# Altium schematic sheet Power.SchDoc
size A4; DocumentNumber: 4; SheetNumber: 2; SheetTotal: 5; SPICEModelCache: <root> / <DocumentId>FYMTCRTF</DocumentId> / <CacheFrame Number="0"> / <Model Name="3020_74438336033_3.3u" Kind="CKT"> / <Text>******* / .subckt 3020_74438336033_3.3u 1 2 / Rp 1 2 6097.32637741 / Cp 1 2 5.7471916388p / Rs 1 N3 0.099 / L1 N3 2 2.92u / .ends 3020_74438336033_3.3u</Text> / </Model> / </CacheFrame> / </root>
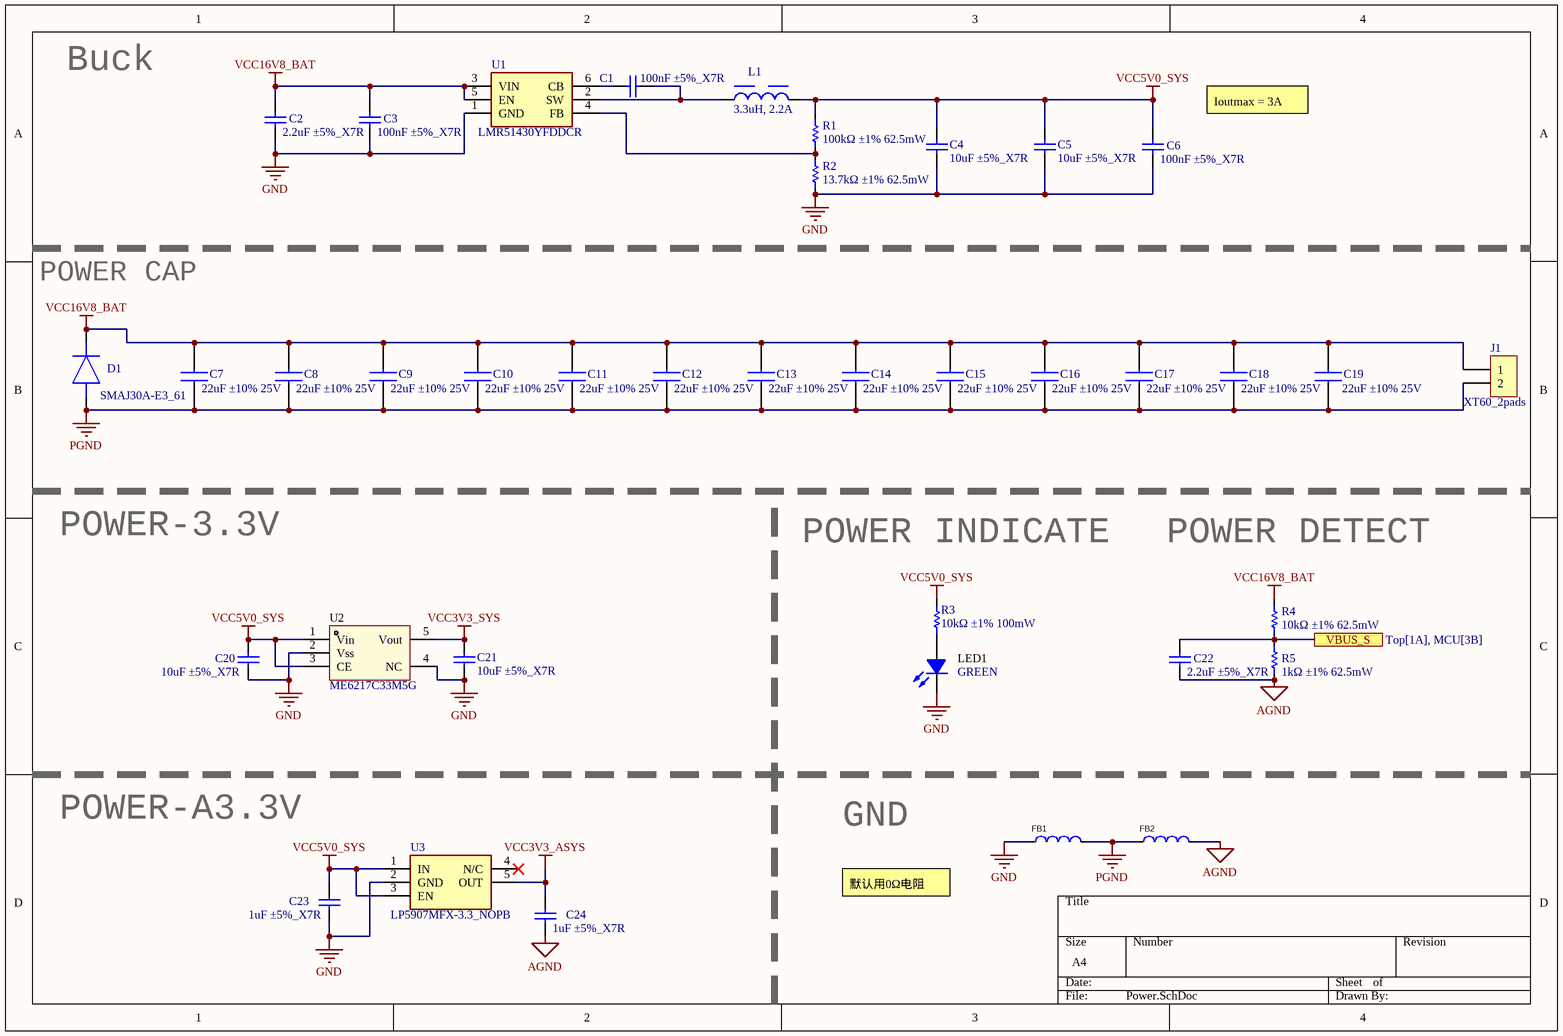
[diagram p0: Power.SchDoc]

## Parts
C1  100nF ±5%_X7R  [C0402]
C2  2.2uF ±5%_X7R  [C0603]
C3  100nF ±5%_X7R  [C0402]
C4  10uF ±5%_X7R  [C0603]
C5  10uF ±5%_X7R  [C0603]
C6  100nF ±5%_X7R  [C0402]
C7  22uF ±10% 25V  [CAPC3225X270N]
C8  22uF ±10% 25V  [CAPC3225X270N]
C9  22uF ±10% 25V  [CAPC3225X270N]
C10  22uF ±10% 25V  [CAPC3225X270N]
C11  22uF ±10% 25V  [CAPC3225X270N]
C12  22uF ±10% 25V  [CAPC3225X270N]
C13  22uF ±10% 25V  [CAPC3225X270N]
C14  22uF ±10% 25V  [CAPC3225X270N]
C15  22uF ±10% 25V  [CAPC3225X270N]
C16  22uF ±10% 25V  [CAPC3225X270N]
C17  22uF ±10% 25V  [CAPC3225X270N]
C18  22uF ±10% 25V  [CAPC3225X270N]
C19  22uF ±10% 25V  [CAPC3225X270N]
C20  10uF ±5%_X7R  [C0603]
C21  10uF ±5%_X7R  [C0603]
C22  2.2uF ±5%_X7R  [C0402]
C23  1uF ±5%_X7R  [C0603]
C24  1uF ±5%_X7R  [C0603]
D1  SMAJ30A-E3_61  [DIOM5127X229N]
FB1  ?Ω@100MHz  [BEADC1608X75N]  (value not drawn)
FB2  ?Ω@100MHz  [BEADC1608X75N]  (value not drawn)
J1  XT60_2pads  [XT60_2pads]
L1  3.3uH, 2.2A  [WE-MAPI_3020]
LED1  GREEN  [LED0603-RD]
R1  100kΩ ±1% 62.5mW  [R0402]
R2  13.7kΩ ±1% 62.5mW  [R0402]
R3  10kΩ ±1% 100mW  [R0603]
R4  10kΩ ±1% 62.5mW  [R0402]
R5  1kΩ ±1% 62.5mW  [R0402]
U1  LMR51430YFDDCR  [SOT95P280X110-6N]
U2  ME6217C33M5G  [SOT-23-5_L3.0-W1.7-P0.95-LS2.8-BR]
U3  LP5907MFX-3.3_NOPB  [SOT95P280X145-5N]

## Ports
VBUS_S (see Top[1A], MCU[3B])

## Nets
AGND: C22.1 C24.1 FB2.2 R5.1
GND: C2.1 C3.1 C4.1 C5.1 C6.1 C20.1 C21.1 C23.1 FB1.1 LED1.2(K) R2.1 U1.1(GND) U2.2(Vss) U2.4(NC) U3.2(GND)
PGND: C7.1 C8.1 C9.1 C10.1 C11.1 C12.1 C13.1 C14.1 C15.1 C16.1 C17.1 C18.1 C19.1 D1.2(A) FB1.2 FB2.1 J1.2
VCC3V3_ASYS: C24.2 U3.5(OUT)
VCC3V3_SYS: C21.2 U2.5(Vout)
VCC5V0_SYS: C4.2 C5.2 C6.2 C20.2 C23.2 L1.2 R1.2 R3.2 U2.1(Vin) U2.3(CE) U3.1(IN) U3.3(EN)
VCC16V8_BAT: C2.2 C3.2 C7.2 C8.2 C9.2 C10.2 C11.2 C12.2 C13.2 C14.2 C15.2 C16.2 C17.2 C18.2 C19.2 D1.1(K) J1.1 R4.2 U1.3(VIN) U1.5(EN)
VBUS_S: C22.2 R4.1 R5.2 ; port VBUS_S
NetC1_1: C1.1 L1.1 U1.2(SW)
NetC1_2: C1.2 U1.6(CB)
NetLED1_1: LED1.1(A) R3.1
NetR1_1: R1.1 R2.2 U1.4(FB)

Not connected (* = marked no-connect by the designer): U3 4(N/C)*

## Notes on the sheet
- Buck
- Ioutmax = 3A
- POWER CAP
- POWER-3.3V
- POWER INDICATE
- POWER DETECT
- POWER-A3.3V
- GND
- 默认用0Ω电阻

## Library data of the parts
C1-C6 C20-C24 = Cap: Capacitor; Published: 8-Jun-2000; LatestRevisionDate: 17-Jul-2002; LatestRevisionNote: Re-released for DXP Platform.; PackageReference: RAD-0.3; Publisher: Altium Limited; PackageDescription: Radial Cap, Thru-Hole; 2 Leads; 0.3 in Pin Spacing
C7-C19 = CL32A226KAJNNNE: Capacitor; Manufacturer_Name: SAMSUNG; Datasheet Link: https://www.arrow.com/en/products/cl32a226kajnnne/samsung-electro-mechanics; Height: 2.7mm; Manufacturer_Part_Number: CL32A226KAJNNNE; Mouser Part Number: 187-CL32A226KAJNNNE; Mouser Price/Stock: https://www.mouser.co.uk/ProductDetail/Samsung-Electro-Mechanics/CL32A226KAJNNNE?qs=hqM3L16%252BxlenZa7Di5a%252Buw%3D%3D; Arrow Part Number: CL32A226KAJNNNE; Arrow Price/Stock: https://www.arrow.com/en/products/cl32a226kajnnne/samsung-electro-mechanics?region=nac
D1 = SMAJ30A-E3_61: Diode; Manufacturer_Name: Vishay; Manufacturer_Part_Number: SMAJ30A-E3/61; Datasheet Link: http://www.vishay.com/docs/88390/smaj50a.pdf; Height: 2.29mm; Mouser Part Number: 625-SMAJ30A-E3; Mouser Price/Stock: https://www.mouser.co.uk/ProductDetail/Vishay-General-Semiconductor/SMAJ30A-E3-61?qs=M2MvrwIlMUxWAZKdikEp%2Fw%3D%3D; Arrow Part Number: SMAJ30A-E3/61; Arrow Price/Stock: https://www.arrow.com/en/products/smaj30a-e361/vishay?region=nac
FB1 FB2 = Ferrite Bead: MPZ1608S601ATA00; Manufacturer: FH(风华); Name: CBW321609U601T; Add into BOM: yes; Impedance @ Frequency: 600Ω@100MHz; Tolerance: ±25%; DC Resistance: 250mΩ; Current Rating: 2A; Circuits: 1; Symbol: CBW321609U601T; Device: CBW321609U601T; LCSC Part Name: 600Ω@100MHz ±25%; Supplier Part: C73732; Manufacturer Part: CBW321609U601T; Supplier Footprint: SMD; JLCPCB Part Class: Extended Part; Datasheet: https://atta.szlcsc.com/upload/public/pdf/source/20160606/1465200211209.pdf; Supplier: LCSC; Convert to PCB: yes
L1 = 74438336033: WE-MAPI, size 3020, 3.3uH, 2.2A, 114mOhm; Manufacturer: Wurth Elektronik; Case/Size Code: 3020; DC Resistance: 99mOhm; Saturation Current: 4.25A; Self Resonant Frequency: 39MHz; Manufacturer Part Number: 74438336033; Match Code: WE-MAPI; ComponentLink1Description: Website Link; ComponentLink1URL: https://www.we-online.com/redexpert/article/74438336033?ad; ComponentLink2Description: Datasheet Link; ComponentLink2URL: https://www.we-online.com/redexpert/spec/74438336033?ad; Mount: Surface Mount; Operating Temperature Max: 125°C; Operating Temperature Min: -40°C; Packaging: Tape and Reel; Length: 3mm; Width: 3mm; Height: 2mm; DC Resistance Max: 114mOhm; Inductance: 3.3uH; Rated Current: 2.2A
LED1 = LED: 发光颜色:; Manufacturer: EVERLIGHT(亿光); Name: 17-21SURC/S530-A2/TR8; Add into BOM: yes; Emitted Color: 红灯; Symbol: 17-21SURC/S530-A2/TR8; Device: 17-21SURC/S530-A2/TR8; LCSC Part Name: 红灯; Supplier Part: C131244; Manufacturer Part: 17-21SURC/S530-A2/TR8; Supplier Footprint: 0805; JLCPCB Part Class: Extended Part; Datasheet: https://atta.szlcsc.com/upload/public/pdf/source/20170918/C131244_1505726880590976254.pdf; Supplier: LCSC; Convert to PCB: yes
R1-R5 = Res: Resistor; Published: 8-Jun-2000; LatestRevisionDate: 17-Jul-2002; LatestRevisionNote: Re-released for DXP Platform.; PackageReference: AXIAL-0.3; Publisher: Altium Limited; PackageDescription: Axial Device, Thru-Hole; 2 Leads; 0.3 in Pin Spacing
U1 = LMR51430YFDDCR: Integrated Circuit; Manufacturer_Name: Texas Instruments; Datasheet Link: https://www.ti.com/lit/gpn/LMR51430; Height: 1.1mm; Manufacturer_Part_Number: LMR51430YFDDCR; Mouser Part Number: 595-LMR51430YFDDCR; Mouser Price/Stock: https://www.mouser.co.uk/ProductDetail/Texas-Instruments/LMR51430YFDDCR?qs=vvQtp7zwQdObTljc3WTMYQ%3D%3D; Arrow Part Number: LMR51430YFDDCR; Arrow Price/Stock: null?utm_currency=USD&region=nac
U2 = ME6217C33M5G: Manufacturer: MICRONE(南京微盟); Add into BOM: yes; Output Type: 固定; Output Polarity: 正; Number of Outputs: 1; Maximum Input Voltage: 7V; Output Voltage: 3.3V; Dropout Voltage: 180mV@(300mA); Output Current: 800mA; Power Supply Rejection Ratio (PSRR): 65dB@(1kHz); Name: ME6217C33M5G; Symbol: ME6217C33M5G; Device: ME6217C33M5G; LCSC Part Name: ME6217C33M5G; Supplier Part: C427602; Manufacturer Part: ME6217C33M5G; Supplier Footprint: SOT-23-5; JLCPCB Part Class: Extended Part; Datasheet: https://atta.szlcsc.com/upload/public/pdf/source/20190910/C427602_D4B9162A2E9D9EF57C60010DFDECEF37.pdf; Supplier: LCSC; Convert to PCB: yes; Quiescent Current (Ground Current): -
U3 = LP5907MFX-3.3_NOPB: Integrated Circuit; Manufacturer_Name: Texas Instruments; Manufacturer_Part_Number: LP5907MFX-3.3/NOPB; Datasheet Link: https://datasheet.datasheetarchive.com/originals/distributors/Datasheets-SFU2/DSASFU100037200.pdf; Height: 1.45mm; Mouser Part Number: 595-LP5907MFX-3.3NPB; Mouser Price/Stock: https://www.mouser.co.uk/ProductDetail/Texas-Instruments/LP5907MFX-3.3-NOPB?qs=biyDIajrTn6NhrJCoL%2FdSQ%3D%3D; Arrow Part Number: LP5907MFX-3.3/NOPB; Arrow Price/Stock: https://www.arrow.com/en/products/lp5907mfx-3.3nopb/texas-instruments?utm_currency=USD&region=nac